# EAGLE design Parallel Drives (EAGLE 9.0.0)
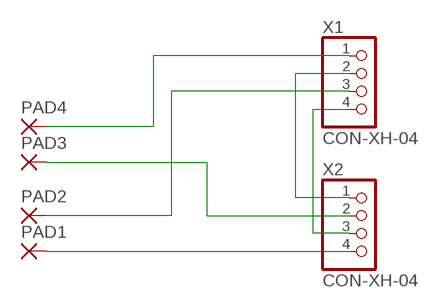
[diagram p0: schematic, sheet 1]

## Parts
PAD1  SMD2  [SMD1,27-2,54]
PAD2  SMD2  [SMD1,27-2,54]
PAD3  SMD2  [SMD1,27-2,54]
PAD4  SMD2  [SMD1,27-2,54]
X1  CON-XH-04  [XH-04]
X2  CON-XH-04  [XH-04]

## Nets
N$1: PAD1.1(P) X2.4
N$2: X1.4 X2.3
N$3: PAD2.1(P) X1.3
N$4: PAD3.1(P) X2.2
N$5: X1.2 X2.1
N$6: PAD4.1(P) X1.1

## Library data of the parts
PAD1-PAD4 = wirepad:SMD2: SMD PAD
X1 X2 = Flamberm:CON-XH-04

## Board
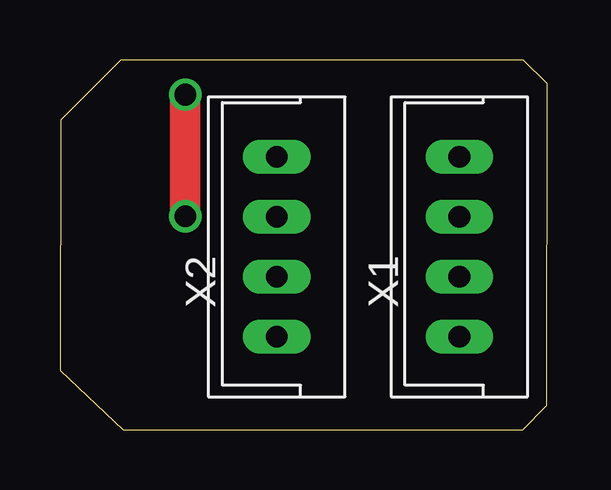
[diagram p1: board, top side]
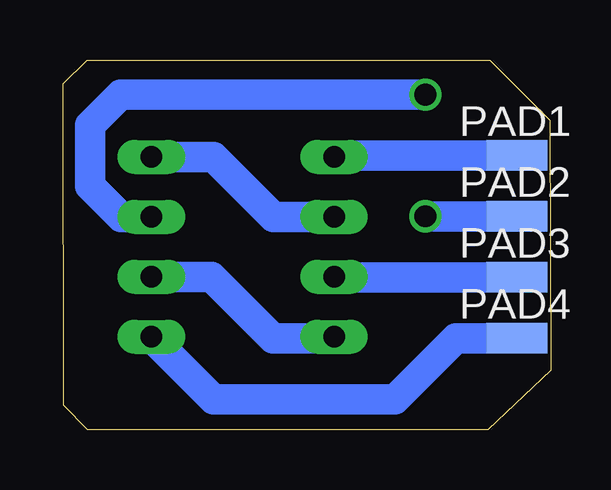
[diagram p2: board, bottom side, seen from below]

Size 20.33 x 15.42 mm. Coordinates in mm from the lower left corner, seen from the top.
Outline: 2.63,0 19.31,0 20.31,1.01 20.33,14.43 19.33,15.42 2.54,15.42 0.04,12.9 0,2.48 2.63,0
Copper layers (1*16): Top 0.035mm / dielectric 1.5mm / Bottom 0.035mm
Design rules "EagleDesignRules": minimum track width 0.25mm, minimum drill 0.3mm, track to track 0.25mm, track to pad 0.25mm, pad to pad 0.25mm, via to via 0.25mm, smd to smd 0.25mm, copper to edge 0.5mm, drill to drill 0.5mm, minimum pad ring 10mil, minimum via ring 8mil, stop-mask expansion 4mil, vias tented up to drill 0mil, thermal gap 0.25mm

### Footprints (pad centres in the part's own frame; a part is rotated, then mirrored left to right if it is on the bottom)
SMD1,27-2,54 = smd 1.27 x 2.54: 1 0,0
XH-04 = drill 0.9 long: 1 -3.75,0; 2 -1.25,0; 3 1.25,0; 4 3.75,0

### Placement (x,y rotation side)
PAD1  1.42,11.43 270 bottom
PAD2  1.42,8.89 270 bottom
PAD3  1.42,6.35 270 bottom
PAD4  1.42,3.81 270 bottom
X1  16.66,7.62 90 top
X2  9.04,7.62 90 top

### Tracks (layer width: path | path; a pad name or v marks a point on that pad's centre or on a via)
N$1
  Bottom 1.27: PAD1.1 8.98,11.43 X2.4
N$2
  Bottom 1.27: X1.4 14.06,11.37 11.56,8.87 X2.3
N$3  (via drill 0.9)
  Top 1.27: v5.23,8.89 v5.23,13.97
  Bottom 1.27: PAD2.1 v5.23,8.89 | v5.23,13.97 17.93,13.97 19.2,12.7 19.2,10.16 17.91,8.87 X1.3
N$4
  Bottom 1.27: PAD3.1 9.02,6.35 X2.2
N$5
  Bottom 1.27: X1.2 14.14,6.37 11.58,3.81 9.1,3.81 X2.1
N$6
  Bottom 1.27: PAD4.1 3.96,3.81 6.5,1.27 14.06,1.27 X1.1